# Altium schematic sheet 01_POWER.SchDoc
size A4; Date: 2015-08-03; PageSetup: Record=PageOptions|CenterHorizontal=True|CenterVertical=True|PrintScale=0.97|XCorrection=1.00|YCorrection=1.00|PrintKind=0|BorderSize=5000000|LeftOffset=0|BottomOffset=0|Orientation=2|PaperLength=1000|PaperWidth=1000|Scale=100|PaperSource=7|PrintQuality=-4|MediaType=1|DitherType=10|PaperKind=A4|PrintScaleMode=1
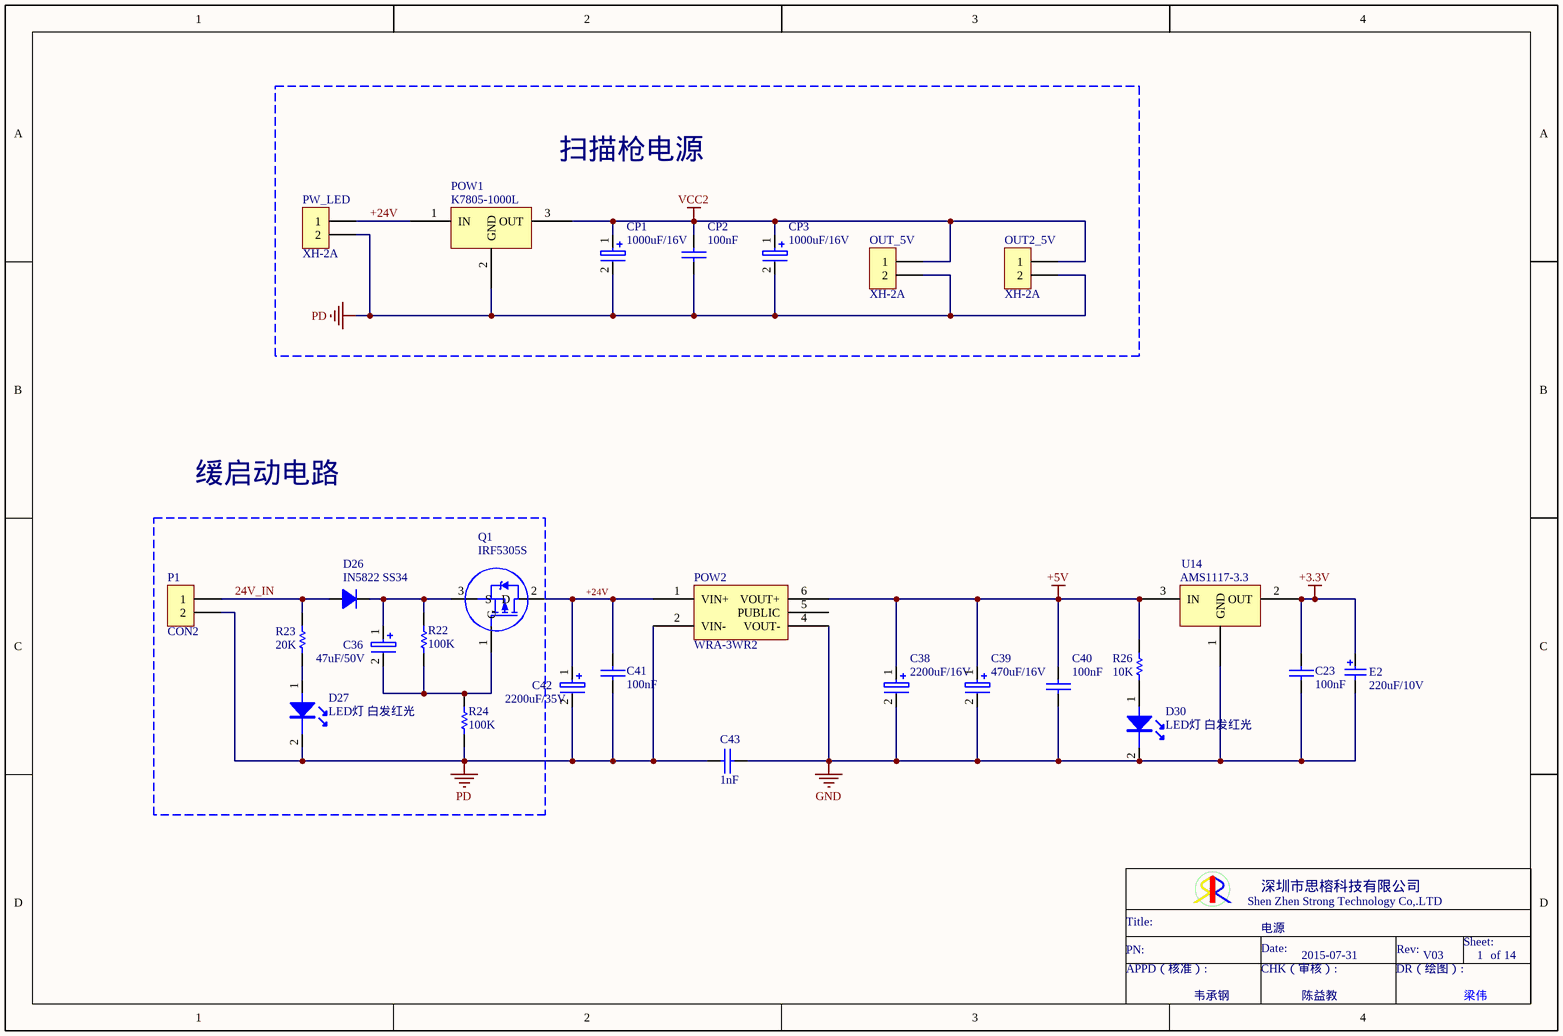
[diagram p0: 01_POWER.SchDoc]

## Parts
C23  100nF  [0603C]
C36  47uF/50V  [RB6.3*11]
C38  2200uF/16V  [RB10*20]
C39  470uF/16V  [RB8*11.5]
C40  100nF  [0805C]
C41  100nF  [0805C]
C42  2200uF/35V  [RB16*25]
C43  1nF  [1206C]
CP1  1000uF/16V  [RB8*11.5]
CP2  100nF  [0805C]
CP3  1000uF/16V  [RB8*11.5]
D26  IN5822 SS34  [DO-214AA]
D27  LED灯 白发红光  [D0603]
D30  LED灯 白发红光  [D0603]
E2  220uF/10V  [6032]
OUT2_5V  XH-2A  [CN2-2.54]
OUT_5V  XH-2A  [CN2-2.54]
P1  CON2  [CON-2_5.08]
POW1  K7805-1000L  [K7805-1000L]
POW2  WRA-3WR2  [WRA-3WR2]
PW_LED  XH-2A  [CN2-2.54]
Q1  IRF5305S  [TO-252]
R22  100K  [0805R]
R23  20K  [0805R]
R24  100K  [0805R]
R26  10K  [0603R]
U14  AMS1117-3.3  [SOT223_CX1117]

## Blocks framed on the sheet
扫描枪电源: CP1-CP3 OUT2_5V OUT_5V POW1 PW_LED

## Nets
+3.3V: C23.2 E2.1 U14.2(OUT)
+5V: C38.1 C39.1 C40.1 POW2.6(VOUT+) R26.2 U14.3(IN)
GND: C23.1 C38.2 C39.2 C40.2 C43.2 D30.2 E2.2 POW2.4(VOUT-) U14.1(GND)
PD: C41.2 C42.2 C43.1 CP1.2 CP2.2 CP3.2 D27.2 OUT2_5V.2 OUT_5V.2 P1.2 POW1.2(GND) POW2.2(VIN-) PW_LED.2 R24.1
VCC2: CP1.1 CP2.1 CP3.1 OUT2_5V.1 OUT_5V.1 POW1.3(OUT)
24V_IN: D26.1 P1.1 R23.2
+24V: C41.1 C42.1 POW1.1(IN) POW2.1(VIN+) PW_LED.1 Q1.2(D)
NetC36_1: C36.1 D26.2 Q1.3(S) R22.2
NetC36_2: C36.2 Q1.1(G) R22.1 R24.2
NetD27_1: D27.1 R23.1
NetD30_1: D30.1 R26.1

Not connected (* = marked no-connect by the designer): POW2 5(PUBLIC)

## Notes on the sheet
- 缓启动电路
- 电源
- 2015-07-31
- V03
- 1
- 14
- 韦承钢
- 陈益教
- Shen Zhen Strong Technology Co,.LTD
- 深圳市思榕科技有限公司
- Title:
- PN:
- APPD（核准）:
- Date:
- CHK（审核）:
- DR（绘图）:
- Rev:
- Sheet:
- of
- 梁伟

## Library data of the parts
C23 = CAP
C36 C38 C39 C42 CP1 CP3 = CAP2: 电解电容器
C40 C41 C43 CP2 = CAP: Capacitor
D26 = DIODE-D
D27 D30 = LED: LED灯
E2 = 电解电容: Bi-Polar Capacitor; Value: 220uF/10V
OUT2_5V OUT_5V PW_LED = CON2
POW2 = Component_1
Q1 = MOSFET-P: P型MOSFET
R22-R24 R26 = RES
U14 = CX1117